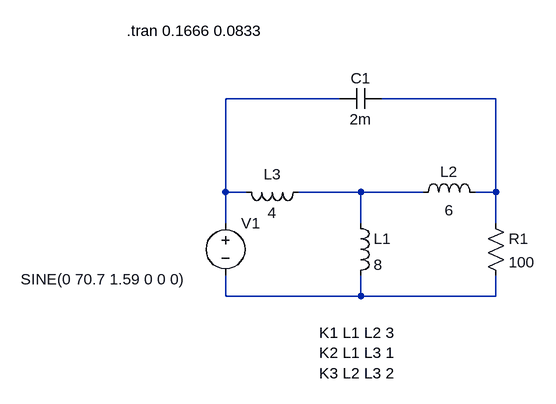
[diagram p0: schematic LAB 5.asc]
LAB 5.asc, the LTspice schematic file:
Version 4.1
SHEET 1 880 680
WIRE 96 -80 -80 -80
WIRE 336 -80 160 -80
WIRE -80 64 -80 -80
WIRE -48 64 -80 64
WIRE 128 64 32 64
WIRE 224 64 128 64
WIRE 336 64 336 -80
WIRE 336 64 304 64
WIRE -80 112 -80 64
WIRE 128 112 128 64
WIRE 336 112 336 64
WIRE -80 224 -80 192
WIRE 128 224 128 192
WIRE 128 224 -80 224
WIRE 336 224 336 192
WIRE 336 224 128 224
SYMBOL ind 112 96 R0
SYMATTR InstName L1
SYMATTR Value 8
SYMATTR Type ind
SYMBOL ind 208 80 R270
WINDOW 0 32 56 VTop 2
WINDOW 3 4 56 VBottom 2
SYMATTR InstName L2
SYMATTR Value 6
SYMATTR Type ind
SYMBOL ind 48 48 R90
WINDOW 0 4 56 VBottom 2
WINDOW 3 32 56 VTop 2
SYMATTR InstName L3
SYMATTR Value 4
SYMATTR Type ind
SYMBOL cap 160 -96 R90
WINDOW 0 0 32 VBottom 2
WINDOW 3 32 32 VTop 2
SYMATTR InstName C1
SYMATTR Value 2m
SYMBOL res 320 96 R0
SYMATTR InstName R1
SYMATTR Value 100
SYMBOL voltage -80 96 R0
WINDOW 3 -315 102 Left 2
WINDOW 123 0 0 Left 0
WINDOW 39 0 0 Left 0
SYMATTR InstName V1
SYMATTR Value SINE(0 70.7 1.59 0 0 0)
TEXT 64 280 Left 2 !K1 L1 L2 3\nK2 L1 L3 1\nK3 L2 L3 2
TEXT -232 -184 Left 2 !.tran 0.1666 0.0833

The netlist it stands for:
* LAB 5.asc
L1 N003 N004 8
L2 N003 N002 6
L3 N003 N001 4
C1 N002 N001 2m
R1 N002 N004 100
V1 N001 N004 SINE(0 70.7 1.59 0 0 0)
K1 L1 L2 3
K2 L1 L3 1
K3 L2 L3 2
.tran 0.1666 0.0833
.backanno
.end